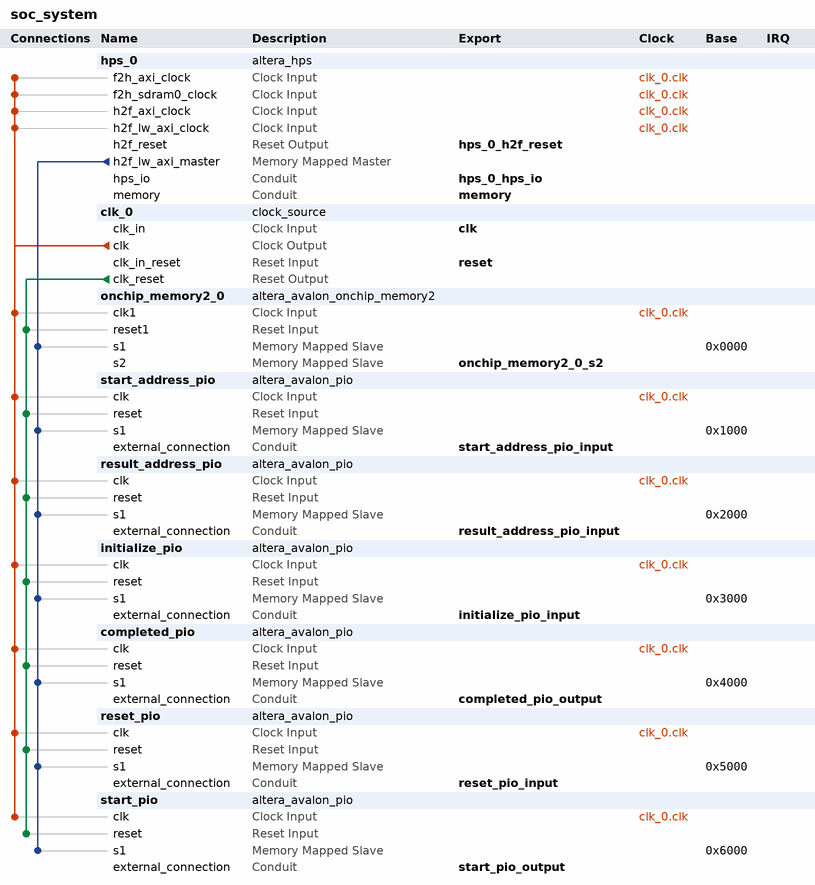
[diagram p0: system contents]
# Platform Designer (Qsys) system soc_system, Cyclone V 5CSEBA6U23I7
# Parameters at their usual value, and those the tool derives, are not listed.
package require -exact qsys 18.1
create_system soc_system
set_project_property DEVICE_FAMILY {Cyclone V}
set_project_property DEVICE 5CSEBA6U23I7

add_instance hps_0 altera_hps 18.1
set_instance_parameter_value hps_0 EMAC1_Mode N/A
set_instance_parameter_value hps_0 EMAC1_PinMuxing Unused
set_instance_parameter_value hps_0 F2SCLK_COLDRST_Enable false
set_instance_parameter_value hps_0 F2SCLK_DBGRST_Enable false
set_instance_parameter_value hps_0 F2SCLK_WARMRST_Enable false
set_instance_parameter_value hps_0 F2SDRAM_Width 64
set_instance_parameter_value hps_0 F2SINTERRUPT_Enable false
set_instance_parameter_value hps_0 F2S_Width 2
set_instance_parameter_value hps_0 FPGA_PERIPHERAL_OUTPUT_CLOCK_FREQ_EMAC0_GTX_CLK 100
set_instance_parameter_value hps_0 FPGA_PERIPHERAL_OUTPUT_CLOCK_FREQ_EMAC0_MD_CLK 100.0
set_instance_parameter_value hps_0 FPGA_PERIPHERAL_OUTPUT_CLOCK_FREQ_EMAC1_GTX_CLK 100
set_instance_parameter_value hps_0 FPGA_PERIPHERAL_OUTPUT_CLOCK_FREQ_EMAC1_MD_CLK 100.0
set_instance_parameter_value hps_0 HPS_PROTOCOL DDR3
set_instance_parameter_value hps_0 I2C0_Mode N/A
set_instance_parameter_value hps_0 I2C0_PinMuxing Unused
set_instance_parameter_value hps_0 I2C1_Mode N/A
set_instance_parameter_value hps_0 I2C1_PinMuxing Unused
set_instance_parameter_value hps_0 LWH2F_Enable true
set_instance_parameter_value hps_0 MEM_BANKADDR_WIDTH 3
set_instance_parameter_value hps_0 MEM_CLK_FREQ 400.0
set_instance_parameter_value hps_0 MEM_COL_ADDR_WIDTH 10
set_instance_parameter_value hps_0 MEM_DQ_WIDTH 32
set_instance_parameter_value hps_0 MEM_DRV_STR RZQ/6
set_instance_parameter_value hps_0 MEM_ROW_ADDR_WIDTH 15
set_instance_parameter_value hps_0 MEM_RTT_NOM RZQ/6
set_instance_parameter_value hps_0 MEM_RTT_WR {Dynamic ODT off}
set_instance_parameter_value hps_0 MEM_TCL 7
set_instance_parameter_value hps_0 MEM_TFAW_NS 37.5
set_instance_parameter_value hps_0 MEM_TRAS_NS 35.0
set_instance_parameter_value hps_0 MEM_TRCD_NS 13.75
set_instance_parameter_value hps_0 MEM_TRFC_NS 300.0
set_instance_parameter_value hps_0 MEM_TRP_NS 13.75
set_instance_parameter_value hps_0 MEM_VENDOR Other
set_instance_parameter_value hps_0 MEM_WTCL 7
set_instance_parameter_value hps_0 QSPI_Mode N/A
set_instance_parameter_value hps_0 QSPI_PinMuxing Unused
set_instance_parameter_value hps_0 REF_CLK_FREQ 25.0
set_instance_parameter_value hps_0 S2FCLK_USER2CLK 4
set_instance_parameter_value hps_0 S2F_Width 2
set_instance_parameter_value hps_0 SDIO_Mode N/A
set_instance_parameter_value hps_0 SDIO_PinMuxing Unused
set_instance_parameter_value hps_0 SPIM1_Mode N/A
set_instance_parameter_value hps_0 SPIM1_PinMuxing Unused
set_instance_parameter_value hps_0 STM_Enable false
set_instance_parameter_value hps_0 TIMING_BOARD_AC_SKEW 0.02
set_instance_parameter_value hps_0 TIMING_BOARD_AC_TO_CK_SKEW 0.0
set_instance_parameter_value hps_0 TIMING_BOARD_DQ_TO_DQS_SKEW 0.0
set_instance_parameter_value hps_0 TIMING_BOARD_MAX_CK_DELAY 0.6
set_instance_parameter_value hps_0 TIMING_BOARD_MAX_DQS_DELAY 0.6
set_instance_parameter_value hps_0 TIMING_BOARD_SKEW_BETWEEN_DQS 0.02
set_instance_parameter_value hps_0 TIMING_BOARD_SKEW_CKDQS_DIMM_MAX 0.01
set_instance_parameter_value hps_0 TIMING_BOARD_SKEW_CKDQS_DIMM_MIN -0.01
set_instance_parameter_value hps_0 TIMING_BOARD_SKEW_WITHIN_DQS 0.02
set_instance_parameter_value hps_0 TIMING_TDH 125
set_instance_parameter_value hps_0 TIMING_TDQSCK 400
set_instance_parameter_value hps_0 TIMING_TDQSQ 120
set_instance_parameter_value hps_0 TIMING_TDS 50
set_instance_parameter_value hps_0 TIMING_TIH 250
set_instance_parameter_value hps_0 TIMING_TIS 175
set_instance_parameter_value hps_0 TIMING_TQSH 0.38
set_instance_parameter_value hps_0 UART0_Mode N/A
set_instance_parameter_value hps_0 UART0_PinMuxing Unused
set_instance_parameter_value hps_0 USB1_Mode N/A
set_instance_parameter_value hps_0 USB1_PinMuxing Unused
set_instance_parameter_value hps_0 desired_cfg_clk_mhz 100.0
set_instance_parameter_value hps_0 desired_qspi_clk_mhz 370.0

add_instance clk_0 clock_source 18.1
set_instance_parameter_value clk_0 clockFrequency 50000000

add_instance onchip_memory2_0 altera_avalon_onchip_memory2 18.1
set_instance_parameter_value onchip_memory2_0 dataWidth 8
set_instance_parameter_value onchip_memory2_0 dualPort true
set_instance_parameter_value onchip_memory2_0 initMemContent true
set_instance_parameter_value onchip_memory2_0 initializationFileName onchip_mem.hex
set_instance_parameter_value onchip_memory2_0 memorySize 4096
set_instance_parameter_value onchip_memory2_0 readDuringWriteMode OLD_DATA
set_instance_parameter_value onchip_memory2_0 singleClockOperation true

add_instance start_address_pio altera_avalon_pio 18.1
set_instance_parameter_value start_address_pio direction Output
set_instance_parameter_value start_address_pio width 12

add_instance result_address_pio altera_avalon_pio 18.1
set_instance_parameter_value result_address_pio direction Output
set_instance_parameter_value result_address_pio width 12

add_instance initialize_pio altera_avalon_pio 18.1
set_instance_parameter_value initialize_pio direction Output
set_instance_parameter_value initialize_pio width 1

add_instance completed_pio altera_avalon_pio 18.1
set_instance_parameter_value completed_pio direction Input
set_instance_parameter_value completed_pio width 1

add_instance reset_pio altera_avalon_pio 18.1
set_instance_parameter_value reset_pio direction Output
set_instance_parameter_value reset_pio width 1

add_instance start_pio altera_avalon_pio 18.1
set_instance_parameter_value start_pio direction Output
set_instance_parameter_value start_pio width 1

# connections
add_connection clk_0.clk completed_pio.clk clock
add_connection clk_0.clk hps_0.f2h_axi_clock clock
add_connection clk_0.clk hps_0.f2h_sdram0_clock clock
add_connection clk_0.clk hps_0.h2f_axi_clock clock
add_connection clk_0.clk hps_0.h2f_lw_axi_clock clock
add_connection clk_0.clk initialize_pio.clk clock
add_connection clk_0.clk onchip_memory2_0.clk1 clock
add_connection clk_0.clk reset_pio.clk clock
add_connection clk_0.clk result_address_pio.clk clock
add_connection clk_0.clk start_address_pio.clk clock
add_connection clk_0.clk start_pio.clk clock
add_connection clk_0.clk_reset completed_pio.reset reset
add_connection clk_0.clk_reset initialize_pio.reset reset
add_connection clk_0.clk_reset onchip_memory2_0.reset1 reset
add_connection clk_0.clk_reset reset_pio.reset reset
add_connection clk_0.clk_reset result_address_pio.reset reset
add_connection clk_0.clk_reset start_address_pio.reset reset
add_connection clk_0.clk_reset start_pio.reset reset
add_connection hps_0.h2f_lw_axi_master completed_pio.s1 avalon
set_connection_parameter_value hps_0.h2f_lw_axi_master/completed_pio.s1 baseAddress 0x4000
add_connection hps_0.h2f_lw_axi_master initialize_pio.s1 avalon
set_connection_parameter_value hps_0.h2f_lw_axi_master/initialize_pio.s1 baseAddress 0x3000
add_connection hps_0.h2f_lw_axi_master onchip_memory2_0.s1 avalon
set_connection_parameter_value hps_0.h2f_lw_axi_master/onchip_memory2_0.s1 baseAddress 0x0000
add_connection hps_0.h2f_lw_axi_master reset_pio.s1 avalon
set_connection_parameter_value hps_0.h2f_lw_axi_master/reset_pio.s1 baseAddress 0x5000
add_connection hps_0.h2f_lw_axi_master result_address_pio.s1 avalon
set_connection_parameter_value hps_0.h2f_lw_axi_master/result_address_pio.s1 baseAddress 0x2000
add_connection hps_0.h2f_lw_axi_master start_address_pio.s1 avalon
set_connection_parameter_value hps_0.h2f_lw_axi_master/start_address_pio.s1 baseAddress 0x1000
add_connection hps_0.h2f_lw_axi_master start_pio.s1 avalon
set_connection_parameter_value hps_0.h2f_lw_axi_master/start_pio.s1 baseAddress 0x6000

# exported interfaces
add_interface clk clock sink
set_interface_property clk EXPORT_OF clk_0.clk_in
add_interface completed_pio_output conduit end
set_interface_property completed_pio_output EXPORT_OF completed_pio.external_connection
add_interface hps_0_h2f_reset reset source
set_interface_property hps_0_h2f_reset EXPORT_OF hps_0.h2f_reset
add_interface hps_0_hps_io conduit end
set_interface_property hps_0_hps_io EXPORT_OF hps_0.hps_io
add_interface initialize_pio_input conduit end
set_interface_property initialize_pio_input EXPORT_OF initialize_pio.external_connection
add_interface memory conduit end
set_interface_property memory EXPORT_OF hps_0.memory
add_interface onchip_memory2_0_s2 avalon slave
set_interface_property onchip_memory2_0_s2 EXPORT_OF onchip_memory2_0.s2
add_interface reset reset sink
set_interface_property reset EXPORT_OF clk_0.clk_in_reset
add_interface reset_pio_input conduit end
set_interface_property reset_pio_input EXPORT_OF reset_pio.external_connection
add_interface result_address_pio_input conduit end
set_interface_property result_address_pio_input EXPORT_OF result_address_pio.external_connection
add_interface start_address_pio_input conduit end
set_interface_property start_address_pio_input EXPORT_OF start_address_pio.external_connection
add_interface start_pio_output conduit end
set_interface_property start_pio_output EXPORT_OF start_pio.external_connection

set_interconnect_requirement {$system} qsys_mm.clockCrossingAdapter HANDSHAKE
set_interconnect_requirement {$system} qsys_mm.maxAdditionalLatency 1

save_system soc_system.qsys
